# Altium schematic sheet power.SchDoc
size A4; Projectnumber: OWN-000; Size: A4
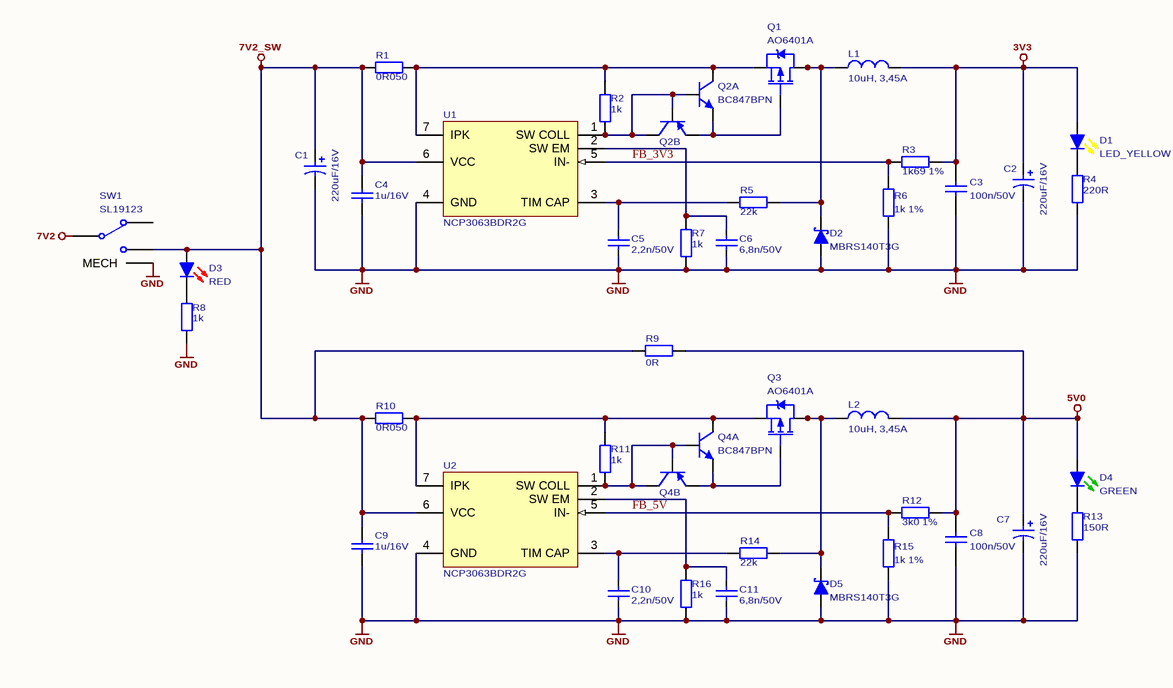
[diagram p0: power.SchDoc]

## Parts
C1  220uF/16V  [CES_E_8.3x8.3_6.2]
C2  220uF/16V  [CES_E_8.3x8.3_6.2]
C3  100n/50V  [C0805]
C4  1u/16V  [C0805]
C5  2,2n/50V  [C0805]
C6  6,8n/50V  [C0805]
C7  220uF/16V  [CES_E_8.3x8.3_6.2]
C8  100n/50V  [C0805]
C9  1u/16V  [C0805]
C10  2,2n/50V  [C0805]
C11  6,8n/50V  [C0805]
D1  LED_YELLOW  [LED0805Y]
D2  MBRS140T3G  [SMB]
D3  RED  [LED0805R]
D4  GREEN  [LED0805G]
D5  MBRS140T3G  [SMB]
L1  10uH, 3,45A  [PSDB1005]
L2  10uH, 3,45A  [PSDB1005]
Q1  AO6401A  [SOT-23-6]
Q2  BC847BPN  [SOT-323-6 (SOT-363, SC88, SC70-6)]  (parts A,B of 2)
Q3  AO6401A  [SOT-23-6]
Q4  BC847BPN  [SOT-323-6 (SOT-363, SC88, SC70-6)]  (parts A,B of 2)
R1  0R050  [R0805]
R2  1k  [R0805]
R3  1k69 1%  [R0805]
R4  220R  [R0805]
R5  22k  [R0805]
R6  1k 1%  [R0805]
R7  1k  [R0805]
R8  1k  [R0805]
R9  0R  [R1206]
R10  0R050  [R0805]
R11  1k  [R0805]
R12  3k0 1%  [R0805]
R13  150R  [R0805]
R14  22k  [R0805]
R15  1k 1%  [R0805]
R16  1k  [R0805]
SW1  SL19123  [500SSPxS1M6xEA]
U1  NCP3063BDR2G  [SO8]
U2  NCP3063BDR2G  [SO8]

## Nets
3V3: C2.1 C3.2 D1.1(A) L1.2 R3.2
5V0: C7.1 C8.2 D4.1(A) L2.2 R9.2 R12.2
7V2: SW1.2
7V2_SW: C1.1 C4.2 C9.2 D3.1(A) R1.1 R9.1 R10.1 SW1.3 U1.6(VCC) U2.6(VCC)
GND: C1.2 C2.2 C3.1 C4.1 C5.1 C6.1 C7.2 C8.1 C9.1 C10.1 C11.1 D2.1(A) D5.1(A) R4.2 R6.2 R7.2 R8.2 R13.2 R15.2 R16.2 SW1.M(MECH) U1.4(GND) U2.4(GND)
FB_3V3: R3.1 R6.1 U1.5(IN-)
FB_5V: R12.1 R15.1 U2.5(IN-)
NetC5_2: C5.2 R5.2 U1.3(TIM_CAP)
NetC6_2: C6.2 R7.1 U1.2(SW_EM)
NetC10_2: C10.2 R14.2 U2.3(TIM_CAP)
NetC11_2: C11.2 R16.1 U2.2(SW_EM)
NetD1_2: D1.2(K) R4.1
NetD2_2: D2.2(K) L1.1 Q1.1(D) Q1.2(D) Q1.5(D) Q1.6(D) R5.1
NetD3_2: D3.2(K) R8.1
NetD4_2: D4.2(K) R13.1
NetD5_2: D5.2(K) L2.1 Q3.1(D) Q3.2(D) Q3.5(D) Q3.6(D) R14.1
NetQ1_3: Q1.3(G) Q2.1(EA) Q2.4(EB)
NetQ1_4: Q1.4(S) Q2.6(CA) R1.2 R2.1 U1.7(IPK)
NetQ2_2: Q2.2(BA) Q2.3(CB) Q2.5(BB) R2.2 U1.1(SW_COLL)
NetQ3_3: Q3.3(G) Q4.1(EA) Q4.4(EB)
NetQ3_4: Q3.4(S) Q4.6(CA) R10.2 R11.1 U2.7(IPK)
NetQ4_2: Q4.2(BA) Q4.3(CB) Q4.5(BB) R11.2 U2.1(SW_COLL)

Not connected (* = marked no-connect by the designer): SW1 1

## Notes on the sheet
- PROJECT NAME:
- PROJECT NO.:
- DATE:
- TITLE:
- SHEET
- of
- DRAWN BY:
- REVISION:
- FILENAME:
- A4

## Library data of the parts
C1 C2 C7 = Cap Pol: Polarized Capacitor; ComponentLink1Description: datasheet; ComponentLink2Description: supplier; Value: 220uF/16V
C3-C6 C8-C11 = Cap: Capacitor; ComponentLink1Description: datasheet; ComponentLink2Description: supplier
  C3 C8: Value: 100n/50V
  C4 C9: Value: 1u/16V
  C5 C10: Value: 2,2n/50V
  C6 C11: Value: 6,8n/50V
D1 = LED_YELLOW: YELLOW LED; Published: 04-Apr-2006
D2 D5 = MBRS140T3G: Schottky barrier rectifier: 40V, 1A; Published: 22-Nov-2006; PackageReference: SMB; Supplier 1: TME; Supplier 2: Farnell; Supplier Part Number 1: MBRS140T3G; Supplier Part Number 2: 1467526
D3 = LED_RED: RED LED; Published: 04-Apr-2006
D4 = LED_GREEN: GREEN LED; Published: 04-Apr-2006
L1 L2 = PSDB1005NT100: 10uH, 20%, 3,45A, PSDB1005N Series Inductor; Published: 08-Mar-2006; ComponentLink1Description: datasheet; ComponentLink2Description: supplier; Supplier 1: TME; Supplier Part Number 1: PSDB1005NT100; Value: 10uH, 3,45A
Q1 Q3 = AO6401A: P-Channel MOSFET; -60V, -5A, 1.3W;; Supplier 1: TME; Supplier Part Number 1: AO6401A
Q2 Q4 = BC847BPN: PNP/NPN General Purpose Transistor (VCE=45V, IC=100mA); Supplier 1: TME; Supplier 2: Farnell; Supplier 3: Farnell; Supplier 4: Farnell; Supplier Part Number 1: BC847BPN.115; Supplier Part Number 2: 2336824; Supplier Part Number 3: 1081233RL; Supplier Part Number 4: 1081233
R1-R16 = Res: Resistor; Published: 19-Feb-2006; ComponentLink1Description: datasheet; ComponentLink2Description: supplier
  R1 R10: Value: 0R050
  R2 R7 R8 R11 R16: Value: 1k
  R3: Value: 1k69 1%
  R4: Value: 220R
  R5 R14: Value: 22k
  R6 R15: Value: 1k 1%
  R9: Value: 0R
  R12: Value: 3k0 1%
  R13: Value: 150R
SW1 = SL19123: Canal Electronic SPDT AC: 3A/250V, DC: 6A/28V; Supplier 1: TME; Supplier Part Number 1: SL19123
U1 U2 = NCP3063BDR2G: DC-DC Converter NCP3063BDR2G (Farnell 1547126); Published: 22-Nov-2006; PackageReference: SO8; Supplier 1: Farnell; Supplier 2: Farnell; Supplier 3: Farnell; Supplier Part Number 1: 1547126; Supplier Part Number 2: 2126136; Supplier Part Number 3: 1547126RL